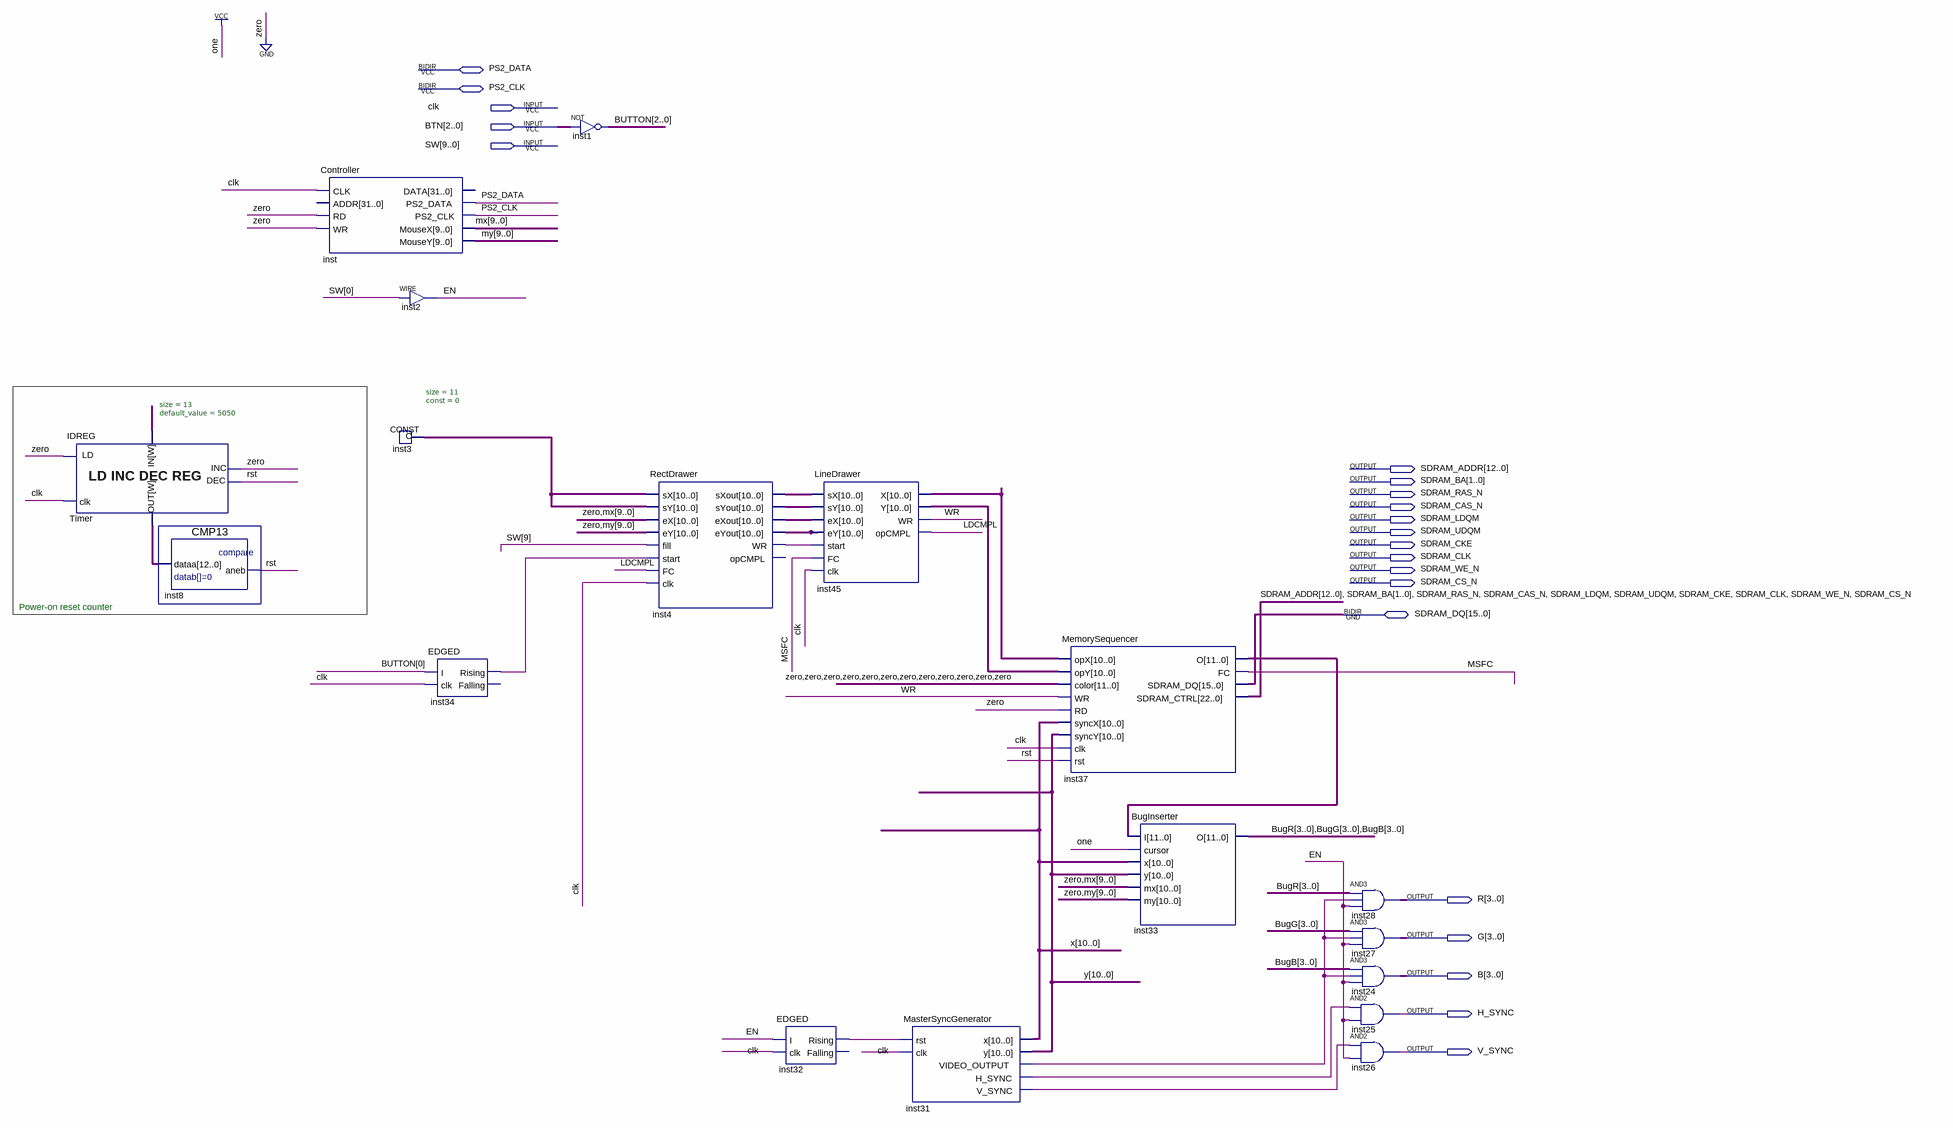
[diagram p0: schematic sheet]
// Quartus schematic GPUTest.bdf as structural Verilog: 18 symbols, 21 pins
module GPUTest (
  input  clk,
  input  [2:0] BTN,
  input  [9:0] SW,
  inout  PS2_DATA,
  inout  PS2_CLK,
  inout  [15:0] SDRAM_DQ,
  output [12:0] SDRAM_ADDR,
  output [1:0] SDRAM_BA,
  output SDRAM_RAS_N,
  output SDRAM_CAS_N,
  output SDRAM_LDQM,
  output SDRAM_UDQM,
  output SDRAM_CKE,
  output SDRAM_CLK,
  output SDRAM_WE_N,
  output SDRAM_CS_N,
  output [3:0] R,
  output [3:0] G,
  output [3:0] B,
  output H_SYNC,
  output V_SYNC
);

  wire EN, inst4_wr, inst31_h_sync, inst31_v_sync, inst31_video_output, inst32_rising, inst34_rising, LDCMPL,
       MSFC, rst, WR;
  wire [2:0] BUTTON;
  wire [3:0] BugB, BugG, BugR;
  wire [9:0] mx, my;
  wire [10:0] inst3_data, inst4_exout, inst4_eyout, inst4_sxout, inst4_syout, inst45_x, inst45_y, x, y;
  wire [11:0] inst37_o;
  wire [12:0] Timer_data_out;

  IDREG #(.size(13), .default_value(5050)) Timer (
    .clk(clk), .data_in({13{1'b0}}), .inc(1'b0), .dec(rst), .ld(1'b0), .data_out(Timer_data_out));
  CMP13 inst8 (.dataa(Timer_data_out), .aneb(rst));
  Controller inst (
    .CLK(clk), .RD(1'b0), .WR(1'b0), .MouseX(mx), .MouseY(my), .PS2_DATA(PS2_DATA), .PS2_CLK(PS2_CLK));  // open: ADDR, DATA
  assign EN = SW[0];  // WIRE inst2
  CONST #(.size(11), .\const (0)) inst3 (.data(inst3_data));
  EDGED inst34 (.I(BUTTON[0]), .clk(clk), .Rising(inst34_rising));  // open: Falling
  assign BUTTON = ~BTN;  // NOT inst1, 3 bits wide
  RectDrawer inst4 (
    .sX(inst3_data), .sY(inst3_data), .eX({1'b0, mx}), .eY({1'b0, my}), .fill(SW[9]), .start(inst34_rising),
    .FC(LDCMPL), .clk(clk), .sXout(inst4_sxout), .sYout(inst4_syout), .eXout(inst4_exout),
    .eYout(inst4_eyout), .WR(inst4_wr));  // open: opCMPL
  EDGED inst32 (.I(EN), .clk(clk), .Rising(inst32_rising));  // open: Falling
  LineDrawer inst45 (
    .sX(inst4_sxout), .sY(inst4_syout), .eX(inst4_exout), .eY(inst4_eyout), .start(inst4_wr), .FC(MSFC),
    .clk(clk), .X(inst45_x), .Y(inst45_y), .WR(WR), .opCMPL(LDCMPL));
  MasterSyncGenerator inst31 (
    .rst(inst32_rising), .clk(clk), .x(x), .y(y), .VIDEO_OUTPUT(inst31_video_output), .H_SYNC(inst31_h_sync),
    .V_SYNC(inst31_v_sync));
  MemorySequencer inst37 (
    .opX(inst45_x), .opY(inst45_y), .color({12{1'b0}}), .WR(WR), .RD(1'b0), .syncX(x), .syncY(y), .clk(clk),
    .rst(rst), .O(inst37_o), .FC(MSFC),
    .SDRAM_CTRL({SDRAM_ADDR, SDRAM_BA, SDRAM_RAS_N, SDRAM_CAS_N, SDRAM_LDQM, SDRAM_UDQM, SDRAM_CKE, SDRAM_CLK, SDRAM_WE_N, SDRAM_CS_N}),
    .SDRAM_DQ(SDRAM_DQ));
  BugInserter inst33 (
    .I(inst37_o), .cursor(1'b1), .x(x), .y(y), .mx({1'b0, mx}), .my({1'b0, my}), .O({BugR, BugG, BugB}));
  assign R = BugR & {4{inst31_video_output}} & {4{EN}};  // AND3 inst28, 4 bits wide
  assign G = BugG & {4{inst31_video_output}} & {4{EN}};  // AND3 inst27, 4 bits wide
  assign B = BugB & {4{inst31_video_output}} & {4{EN}};  // AND3 inst24, 4 bits wide
  and inst25 (H_SYNC, inst31_h_sync, EN);
  and inst26 (V_SYNC, inst31_v_sync, EN);

  // Notes on the sheet:
  //   Power-on reset counter
endmodule
